# Altium schematic sheet Sheet5.SchDoc
size A4
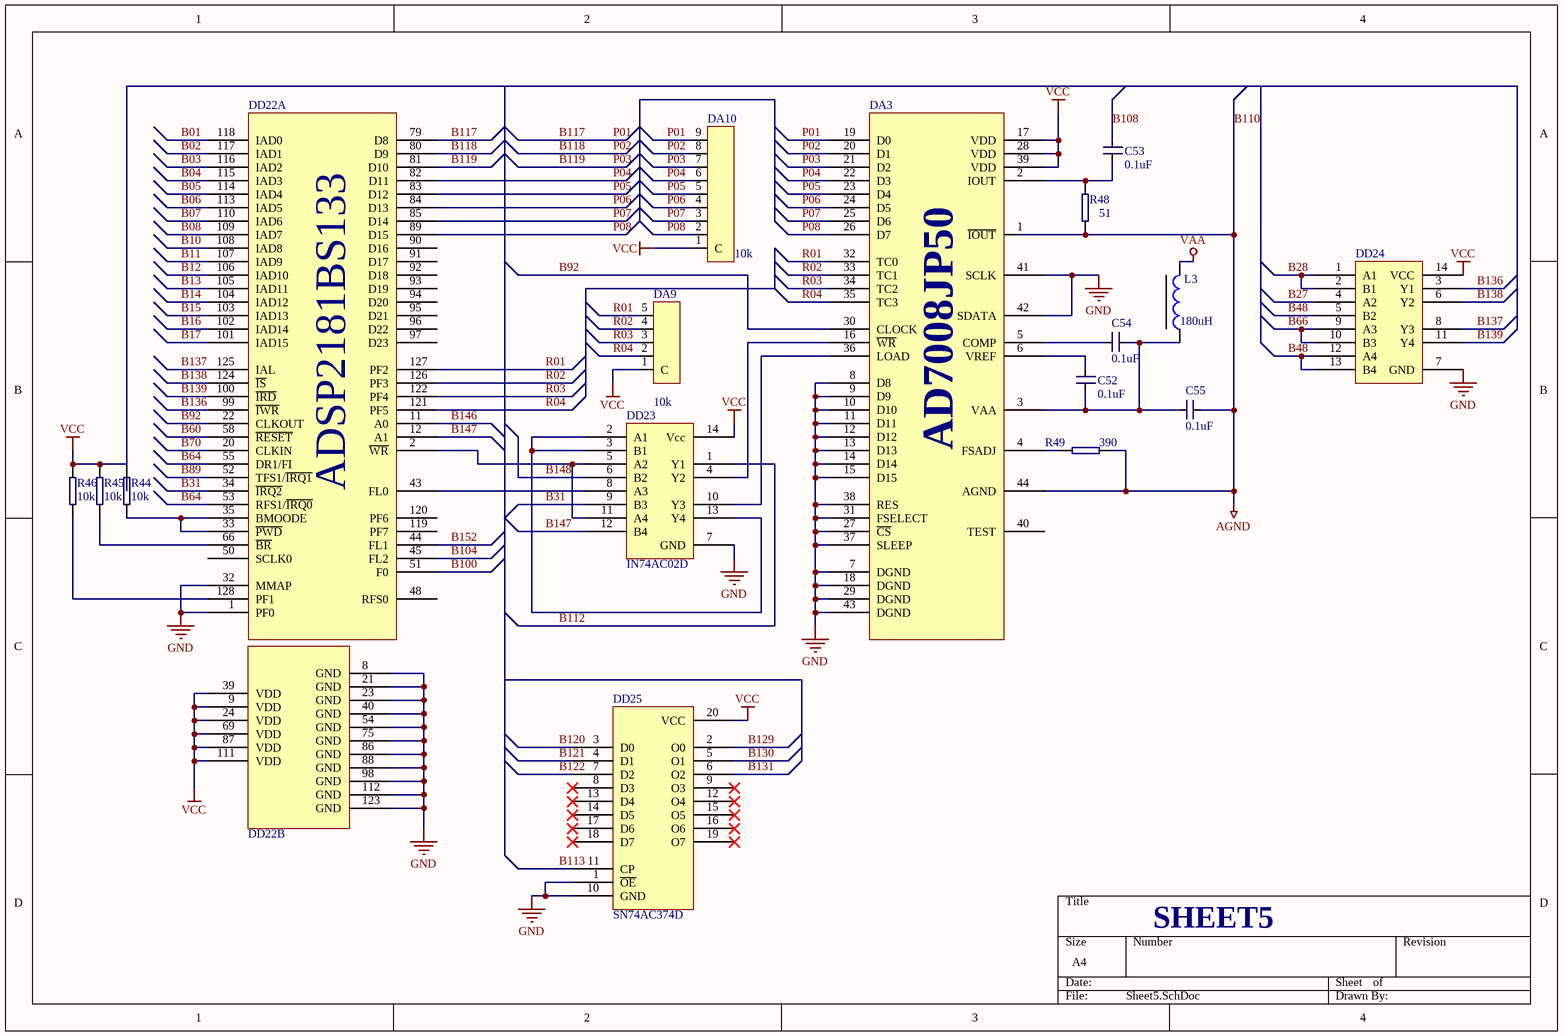
[diagram p0: Sheet5.SchDoc]

## Parts
C52  value 0.1uF  [0805]  (hidden comment: Cap)
C53  value 0.1uF  [0805]  (hidden comment: Cap)
C54  value 0.1uF  [0805]  (hidden comment: Cap)
C55  value 0.1uF  [0805]  (hidden comment: Cap)
DA3  AD7008JP50  [44 PLCC]  (value not drawn)
DA9  value 10k  [5 SIP]  (hidden comment: 5A103J)
DA10  value 10k  [9 SIP]  (hidden comment: 9A103J)
DD22  ADSP2181BS1332  [128 PQFP]  (value not drawn)  (parts A,B of 2)
DD23  IN74AC02D  [14 SOIC-3.9]
DD24  IN74AC08D  [14 TSSOP-4.4]  (value not drawn)
DD25  SN74AC374D  [20 SOIC-7.5]
L3  value 180uH  [E(1820)]  (hidden comment: L)
R44  value 10k  [0805]  (hidden comment: R)
R45  value 10k  [0805]  (hidden comment: R)
R46  value 10k  [0805]  (hidden comment: R)
R48  value 51  [0805]  (hidden comment: R)
R49  value 390  [0805]  (hidden comment: R)

## Nets
B110: C55.1 DA3.1(~{IOUT}) DA3.44(AGND) R48.1 R49.2  [also labelled AGND]
GND: DA3.7(DGND) DA3.8(D8) DA3.9(D9) DA3.10(D10) DA3.11(D11) DA3.12(D12) DA3.13(D13) DA3.14(D14) DA3.15(D15) DA3.18(DGND) DA3.27(~{CS}) DA3.29(DGND) DA3.31(FSELECT) DA3.37(SLEEP) DA3.38(RES) DA3.41(SCLK) DA3.42(SDATA) DA3.43(DGND) DD22.1(PF0) DD22.8(GND) DD22.21(GND) DD22.23(GND) DD22.32(MMAP) DD22.40(GND) DD22.54(GND) DD22.75(GND) DD22.86(GND) DD22.88(GND) DD22.98(GND) DD22.112(GND) DD22.123(GND) DD23.7(GND) DD24.7(GND) DD25.1(~{OE}) DD25.10(GND)
VAA: L3.2
VCC: DA3.17(VDD) DA3.28(VDD) DA3.39(VDD) DA9.1(C) DA10.1(C) DD22.9(VDD) DD22.24(VDD) DD22.39(VDD) DD22.69(VDD) DD22.87(VDD) DD22.111(VDD) DD23.14(Vcc) DD24.14(VCC) DD25.20(VCC) R44.2 R45.2 R46.2
B01: DD22.118(IAD0)
B02: DD22.117(IAD1)
B03: DD22.116(IAD2)
B04: DD22.115(IAD3)
B05: DD22.114(IAD4)
B06: DD22.113(IAD5)
B07: DD22.110(IAD6)
B08: DD22.109(IAD7)
B10: DD22.108(IAD8)
B11: DD22.107(IAD9)
B12: DD22.106(IAD10)
B13: DD22.105(IAD11)
B14: DD22.104(IAD12)
B15: DD22.103(IAD13)
B16: DD22.102(IAD14)
B17: DD22.101(IAD15)
B27: DD24.4(A2)
B28: DD24.1(A1) DD24.2(B1)
B31: DD22.34(~{IRQ2}) DD23.9(B3)
B48: DD24.5(B2) DD24.12(A4) DD24.13(B4)
B60: DD22.58(~{RESET})
B64: DD22.53(RFS1/~{IRQ0}) DD22.55(DR1/FI)
B66: DD24.9(A3) DD24.10(B3)
B70: DD22.20(CLKIN)
B89: DD22.52(TFS1/~{IRQ1})
B92: DA3.30(CLOCK) DD22.22(CLKOUT)
B100: DD22.51(F0)
B104: DD22.45(FL2)
B108: C53.2
B112: DD23.1(Y1)
B113: DD25.11(CP)
B117: DA3.19(D0) DA10.9 DD22.79(D8)  [also labelled P01]
B118: DA3.20(D1) DA10.8 DD22.80(D9)  [also labelled P02]
B119: DA3.21(D2) DA10.7 DD22.81(D10)  [also labelled P03]
B120: DD25.3(D0)
B121: DD25.4(D1)
B122: DD25.7(D2)
B129: DD25.2(O0)
B130: DD25.5(O1)
B131: DD25.6(O2)
B136: DD22.99(~{IWR}) DD24.3(Y1)
B137: DD22.125(IAL) DD24.8(Y3)
B138: DD22.124(~{IS}) DD24.6(Y2)
B139: DD22.100(~{IRD}) DD24.11(Y4)
B146: DD22.11(A0)
B147: DD22.12(A1) DD23.12(B4)
B148: DD23.6(B2)
B152: DD22.44(FL1)
P04: DA3.22(D3) DA10.6 DD22.82(D11)
P05: DA3.23(D4) DA10.5 DD22.83(D12)
P06: DA3.24(D5) DA10.4 DD22.84(D13)
P07: DA3.25(D6) DA10.3 DD22.85(D14)
P08: DA3.26(D7) DA10.2 DD22.89(D15)
R01: DA3.32(TC0) DA9.5 DD22.127(PF2)
R02: DA3.33(TC1) DA9.4 DD22.126(PF3)
R03: DA3.34(TC2) DA9.3 DD22.122(PF4)
R04: DA3.35(TC3) DA9.2 DD22.121(PF5)
NetC52_1: C52.1 C54.1 C55.2 DA3.3(VAA) L3.1
NetC52_2: C52.2 DA3.6(VREF)
NetC53_1: C53.1 DA3.2(IOUT) R48.2
NetC54_2: C54.2 DA3.5(COMP)
NetDA3_4: DA3.4(FSADJ) R49.1
NetDA3_16: DA3.16(~{WR}) DD23.4(Y2)
NetDA3_36: DA3.36(LOAD) DD23.10(Y3)
NetDD22_2: DD22.2(~{WR}) DD23.5(A2) DD23.11(A4)
NetDD22_33: DD22.33(~{PWD}) DD22.35(BMOODE) R44.1
NetDD22_43: DD22.43(FL0) DD23.8(A3)
NetDD22_66: DD22.66(~{BR}) R45.1
NetDD22_128: DD22.128(PF1) R46.1
NetDD23_2: DD23.2(A1) DD23.3(B1) DD23.13(Y4)

Not connected (* = marked no-connect by the designer): DA3 40(TEST); DD22 48(RFS0) 50(SCLK0) 90(D16) 91(D17) 92(D18) 93(D19) 94(D20) 95(D21) 96(D22) 97(D23) 119(PF7) 120(PF6); DD25 8(D3)* 9(O3)* 12(O4)* 13(D4)* 14(D5)* 15(O5)* 16(O6)* 17(D6)* 18(D7)* 19(O7)*

## Notes on the sheet
- SHEET5
- (in symbol ADSP2181BS1332, part A) ADSP2181BS133